# EAGLE design tweeq-STAMP_I2C_RTC DS1338 v1 (EAGLE 7.2.0)
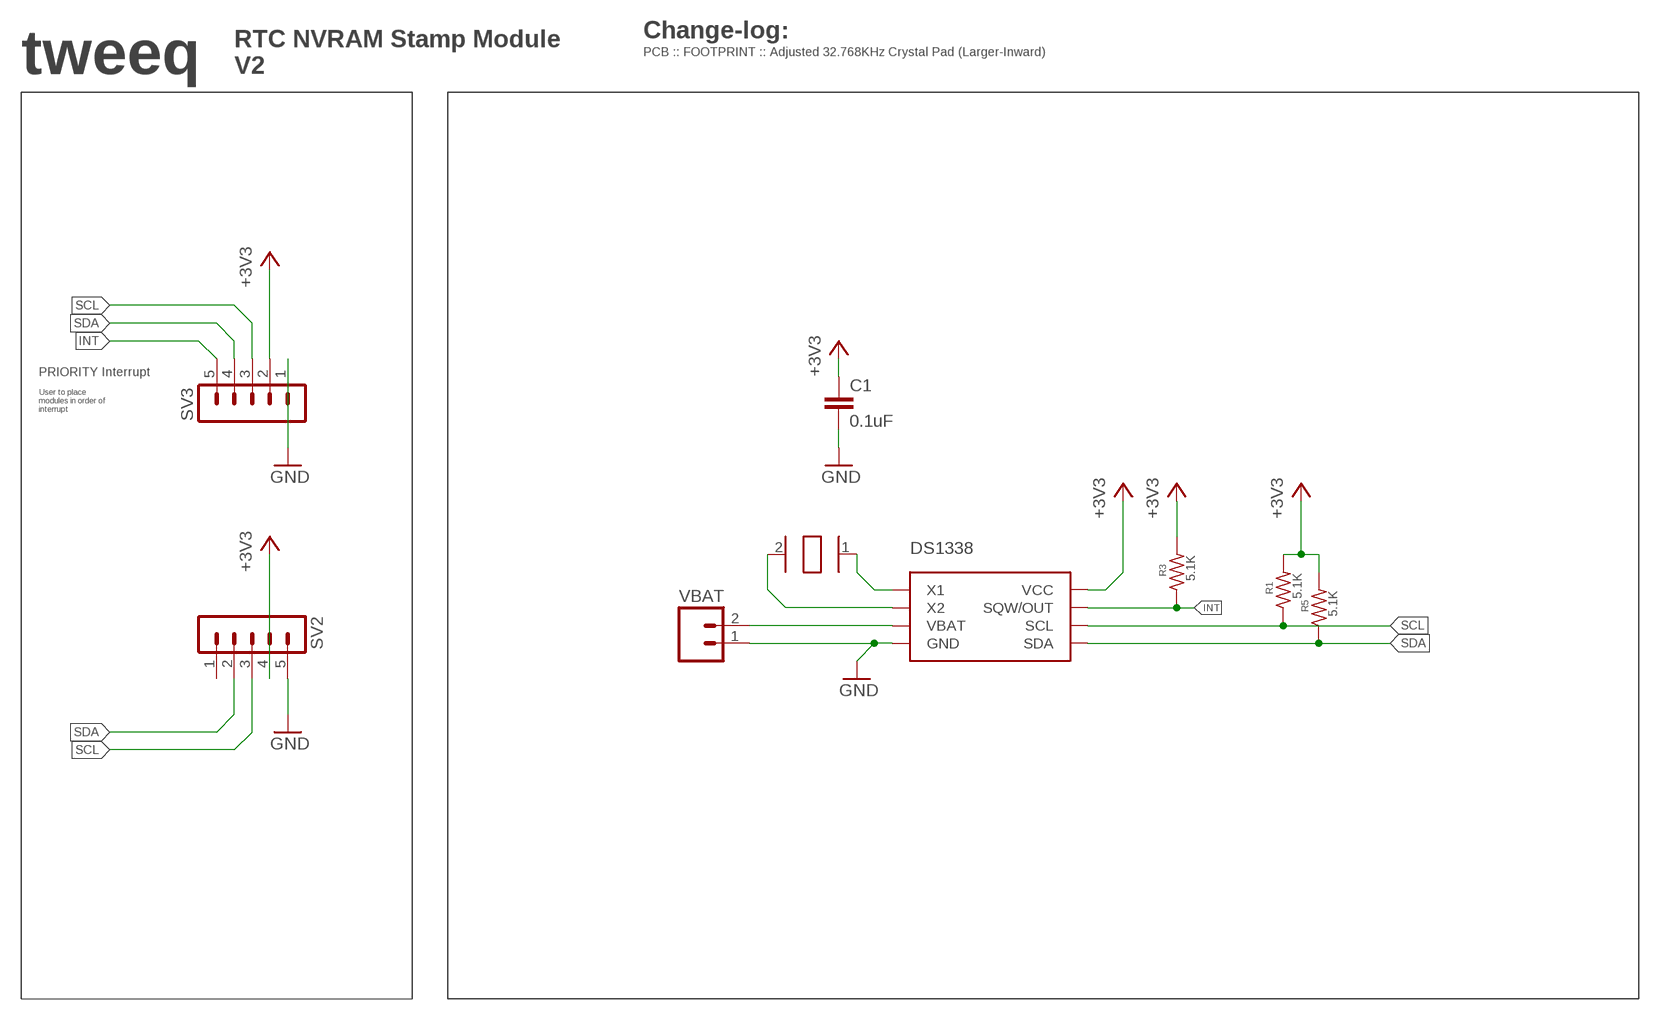
[diagram p0: schematic, sheet 1]

## Parts
C1  0.1uF  C-EUC0402K  [C0402K]
DS1338  DS1338U  [MSOP8]
R1  5.1K  R-US_R0402  [R0402]
R3  5.1K  R-US_R0402  [R0402]
R5  5.1K  R-US_R0402  [R0402]
SV2  M05-1STAMP  [1X05-1.5MM-STAMP]
SV3  M05-1STAMP  [1X05-1.5MM-STAMP]
U$2  32.765KHZ_CRYSTALABS07  [ABS07]
VBAT  M021X02_SMD_SQUARE  [1X02_SMD]

## Nets
+3V3: C1.1 DS1338.8(VCC) R1.2 R3.2 R5.2 SV2.4 SV3.2
GND: C1.2 DS1338.4(GND) SV2.5 SV3.1 VBAT.1
INT: DS1338.7(SQW/OUT) R3.1 SV3.5
N$2: DS1338.2(X2) U$2.2
N$3: DS1338.1(X1) U$2.1
N$4: DS1338.3(VBAT) VBAT.2
SCL: DS1338.6(SCL) R1.1 SV2.3 SV3.3
SDA: DS1338.5(SDA) R5.1 SV2.2 SV3.4
Unconnected: SV2.1

## Notes on the sheet
- Change-log:
- PCB :: FOOTPRINT :: Adjusted 32.768KHz Crystal Pad (Larger-Inward)
- tweeq
- RTC NVRAM Stamp Module
  V2
- PRIORITY Interrupt
- User to place 
  modules in order of 
  interrupt

## Library data of the parts
C1 = AISCube:C-EU: CAPACITOR, European symbol
DS1338 = AISCube:DS1338: DS1338 I2C RTC with 56-Byte NV RAM ▪ 56-Byte Battery-Backed General-Purpose RAM with Unlimited Writes
R1 R3 R5 = rcl:R-US_: RESISTOR, American symbol
SV2 SV3 = AISCube:M05-1: PIN HEADER Standard 0.1" header pin 5 pins - 1 way
U$2 = AISCube:32.765KHZ_CRYSTAL: 32.768KHZ CRYSTAL
VBAT = AISCube:M02: Header 2 Standard 2-pin 0.1" header. Use with straight break away headers (SKU : PRT-00116), right angle break away headers (PRT-00553), swiss pins (PRT-00743), machine pins (PRT-00117), and female headers (PRT-00115). Molex polarized connector foot print use with SKU : PRT-08233 with associated crimp pins and housings.

## Board
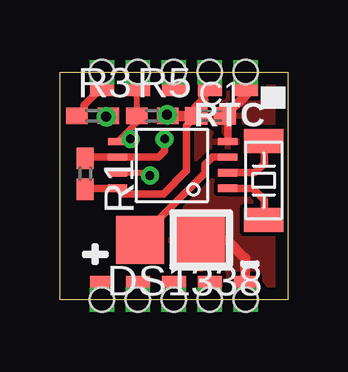
[diagram p1: board, top side]
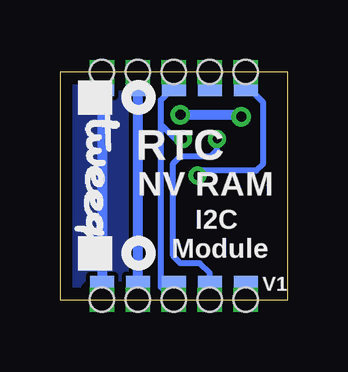
[diagram p2: board, bottom side, seen from below]

Size 9.5 x 9.5 mm. Coordinates in mm from the lower left corner, seen from the top.
Outline: 0,9.5 9.5,9.5 9.5,0 0,0 0,9.5
Copper layers (1*16): Top 0.0356mm / dielectric 1.5011mm / Bottom 0.0356mm
Design rules "AISCube": minimum track width 7mil, minimum drill 14mil, track to track 7mil, track to pad 7mil, pad to pad 7mil, via to via 7mil, smd to smd 0mil, copper to edge 20mil, drill to drill 8mil, minimum pad ring 10mil, minimum via ring 8mil, stop-mask expansion 4mil, vias tented up to drill 32mil, thermal gap 10mil

### Footprints (pad centres in the part's own frame; a part is rotated, then mirrored left to right if it is on the bottom)
C0402K = smd 0.925 x 0.74: 1 -0.6,0; 2 0.6,0
MSOP8 = smd 0.8 x 0.3: 1 -2.1,-0.55; 2 -2.1,-1.2; 3 -2.1,-1.85; 4 -2.1,-2.5; 5 2.5,-2.5; 6 2.5,-1.85; 7 2.5,-1.2; 8 2.5,-0.55
R0402 = smd 0.9 x 0.7: 1 -0.65,0; 2 0.65,0
1X05-1.5MM-STAMP = drill 0.5 pad 1 square: 1 -3,0; 2 -1.5,0; 3 0,0; 4 1.5,0; 5 3,0 | smd 1 x 0.6: P$1 -3,0.7; P$2 -1.5,0.7; P$3 0,0.7; P$4 1.5,0.7; P$5 3,0.7 | smd 1 x 0.6 bottom: P$6 -3,0.7; P$7 -1.5,0.7; P$8 0,0.7; P$9 1.5,0.7; P$10 3,0.7 | hole 1: -3,0; -1.5,0; 0,0; 1.5,0; 3,0
ABS07 = smd 1 x 1.65: 1 -1.65,0.05; 2 1.65,0.05
1X02_SMD = smd 2 x 2: 1 -1.27,0; 2 1.27,0

### Placement (x,y rotation side)
C1  6.29,7.67 0 top
DS1338  4.9,4.1 180 top
R1  1.06,5.26 270 top
R3  1.36,7.67 0 top
R5  3.85,7.67 0 top
SV2  4.75,0 0 top
SV3  4.75,9.5 180 top
U$1  [TWEEQ-LOGO-S]  8.89,7.77 270 bottom
U$2  8.55,4.98 90 top
VBAT  4.61,2.49 180 top

### Tracks (layer width: path | path; a pad name or v marks a point on that pad's centre or on a via)
+3V3  (via drill 0.41)
  Top 0.305: R1.2 1.1,4.65 DS1338.8 2.63,4.42 4.32,4.42 5.28,5.38 5.28,7.26 C1.1 5.69,7.64
  Top 0.406: R3.2 1.98,7.64 v1.93,7.64 | R5.2 C1.1 5.79,7.57 | v4.47,7.72 4.56,7.64 5.69,7.64 5.69,8.03 5.99,8.33 5.99,9.24 SV3.2
  Bottom 0.406: v4.47,7.72 2.02,7.72 v1.93,7.64 | SV2.4 SV3.2
GND
  Top 0.305: DS1338.4 7,7.56 C1.2
  Top 0.406: SV3.1 7.75,8.53 C1.2 | VBAT.1 6.96,2.49 7.72,1.73 7.72,0.03 SV2.5
  Bottom 0.406: SV3.1 SV2.5
  pour Top: 9.3,9.3 9.3,0.18 0.15,0.18 0.15,9.3
  pour Bottom: 9.3,0.18 9.3,9.3 0.15,9.3 0.15,0.18
INT  (via drill 0.36)
  Top 0.254: DS1338.7 3.64,5.3 v3.76,5.18
  Top 0.305: R3.1 1.02,7.97 1.02,8.13 1.75,8.86 SV3.5
  Bottom 0.254: SV3.5 1.73,9.48 1.73,8.94 1.02,8.23 1.02,5.69 1.32,5.38 3.56,5.38 v3.76,5.18
N$2
  Top 0.305: DS1338.2 8.14,5.3 8.53,5.69 8.53,6.6 U$2.2
N$3
  Top 0.305: DS1338.1 8.05,4.65 8.53,4.17 8.53,3.36 U$2.1
N$4
  Top 0.305: VBAT.2 3.35,2.58 6.04,5.28 6.04,5.64 6.36,5.95 DS1338.3
SCL  (via drill 0.36)
  Top 0.305: R1.1 1.1,5.95 DS1338.6 4.12,5.95 4.37,6.2 v4.37,6.71
  Bottom 0.254: SV3.3 4.75,8.86 5.28,8.33 5.28,7.32 | SV2.3 5.28,0.53 5.28,7.32 | v4.37,6.71 4.67,6.71 5.28,7.32
SDA  (via drill 0.36)
  Top 0.254: SV3.4 3.2,9.45 R5.1 3.2,7.4 DS1338.5 2.64,6.6 v2.95,6.71
  Bottom 0.254: SV2.2 3.25,1.12 3.66,1.52 4.47,1.52 4.78,1.83 4.78,5.69 4.47,5.99 3.2,5.99 2.95,6.25 v2.95,6.71

### Text on the board
tPlace: RTC
bPlace: RTC | NV RAM | I2C / Module | V1
tNames: 6V-9V DC | ON
bNames: Breadboard | V-Reg | Module